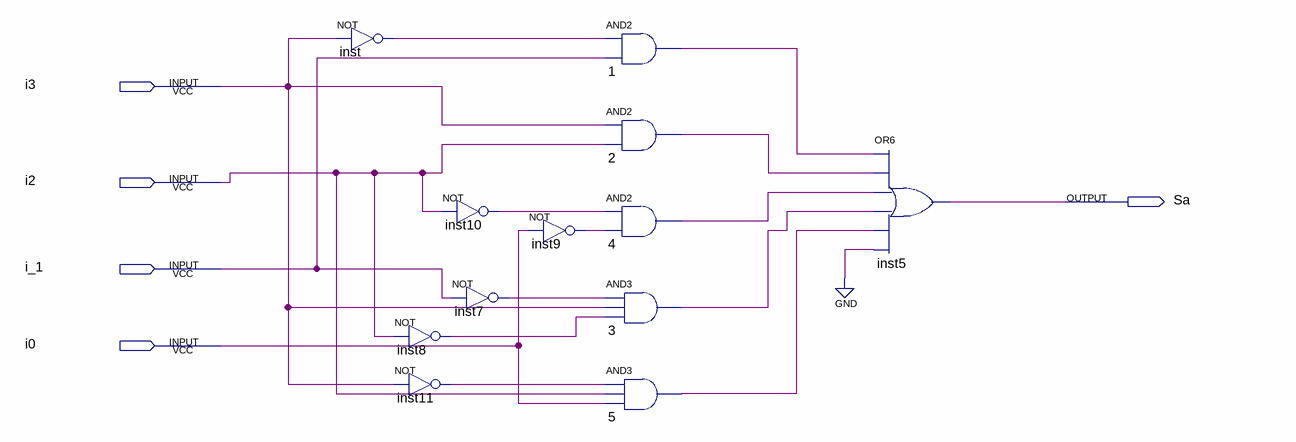
[diagram p0: schematic sheet]
// Quartus schematic fa_top.bdf as structural Verilog: 12 symbols, 5 pins
module fa_top (
  input  i3,
  input  i2,
  input  i_1,
  input  i0,
  output Sa
);

  wire inst7_out, inst8_out, inst9_out, inst10_out, inst11_out, inst_out, n1_out, n2_out, n3_out, n4_out,
       n5_out;

  not inst (inst_out, i3);
  not inst8 (inst8_out, i2);
  not inst11 (inst11_out, i3);
  not inst10 (inst10_out, i2);
  not inst7 (inst7_out, i_1);
  not inst9 (inst9_out, i0);
  and u_1 (n1_out, inst_out, i_1);
  and u_2 (n2_out, i3, i2);
  and u_4 (n4_out, inst10_out, inst9_out);
  and u_3 (n3_out, inst7_out, i3, inst8_out);
  and u_5 (n5_out, inst11_out, i2, i0);
  or inst5 (Sa, n1_out, n2_out, n4_out, n3_out, n5_out, 1'b0);
endmodule
